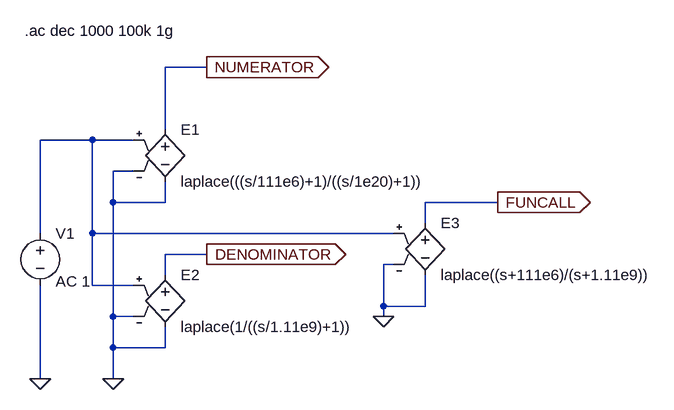
[diagram p0: schematic fig-03-01-47.asc]
fig-03-01-47.asc, the LTspice schematic file:
Version 4
SHEET 1 1172 680
WIRE 304 -16 240 -16
WIRE 240 80 240 -16
WIRE 128 96 48 96
WIRE 192 96 128 96
WIRE 192 144 160 144
WIRE 160 192 160 144
WIRE 240 192 240 160
WIRE 240 192 160 192
WIRE 752 192 640 192
WIRE 640 224 640 192
WIRE 48 240 48 96
WIRE 128 240 128 96
WIRE 592 240 128 240
WIRE 304 272 240 272
WIRE 592 288 576 288
WIRE 240 304 240 272
WIRE 128 320 128 240
WIRE 192 320 128 320
WIRE 576 352 576 288
WIRE 640 352 640 304
WIRE 640 352 576 352
WIRE 160 368 160 192
WIRE 192 368 160 368
WIRE 576 368 576 352
WIRE 160 416 160 368
WIRE 240 416 240 384
WIRE 240 416 160 416
WIRE 48 464 48 320
WIRE 160 464 160 416
FLAG 48 464 0
FLAG 160 464 0
FLAG 576 368 0
FLAG 304 -16 NUMERATOR
IOPIN 304 -16 Out
FLAG 304 272 DENOMINATOR
IOPIN 304 272 Out
FLAG 752 192 FUNCALL
IOPIN 752 192 Out
SYMBOL voltage 48 224 R0
WINDOW 3 -107 200 Left 2
WINDOW 123 24 90 Left 2
WINDOW 39 0 0 Left 0
SYMATTR Value ""
SYMATTR Value2 AC 1
SYMATTR InstName V1
SYMBOL e 240 64 R0
SYMATTR InstName E1
SYMATTR Value laplace(((s/111e6)+1)/((s/1e20)+1))
SYMBOL e 240 288 R0
SYMATTR InstName E2
SYMATTR Value laplace(1/((s/1.11e9)+1))
SYMBOL e 640 208 R0
SYMATTR InstName E3
SYMATTR Value laplace((s+111e6)/(s+1.11e9))
TEXT 24 -72 Left 2 !.ac dec 1000 100k 1g

The netlist it stands for:
* fig-03-01-47.asc
V1 N001 0 AC 1
E1 NUMERATOR 0 N001 0 laplace(((s/111e6)+1)/((s/1e20)+1))
E2 DENOMINATOR 0 N001 0 laplace(1/((s/1.11e9)+1))
E3 FUNCALL 0 N001 0 laplace((s+111e6)/(s+1.11e9))
.ac dec 1000 100k 1g
.backanno
.end